# EAGLE schematic EE474FINAL (EAGLE 9.5.1)

## Sheet 1 of 2
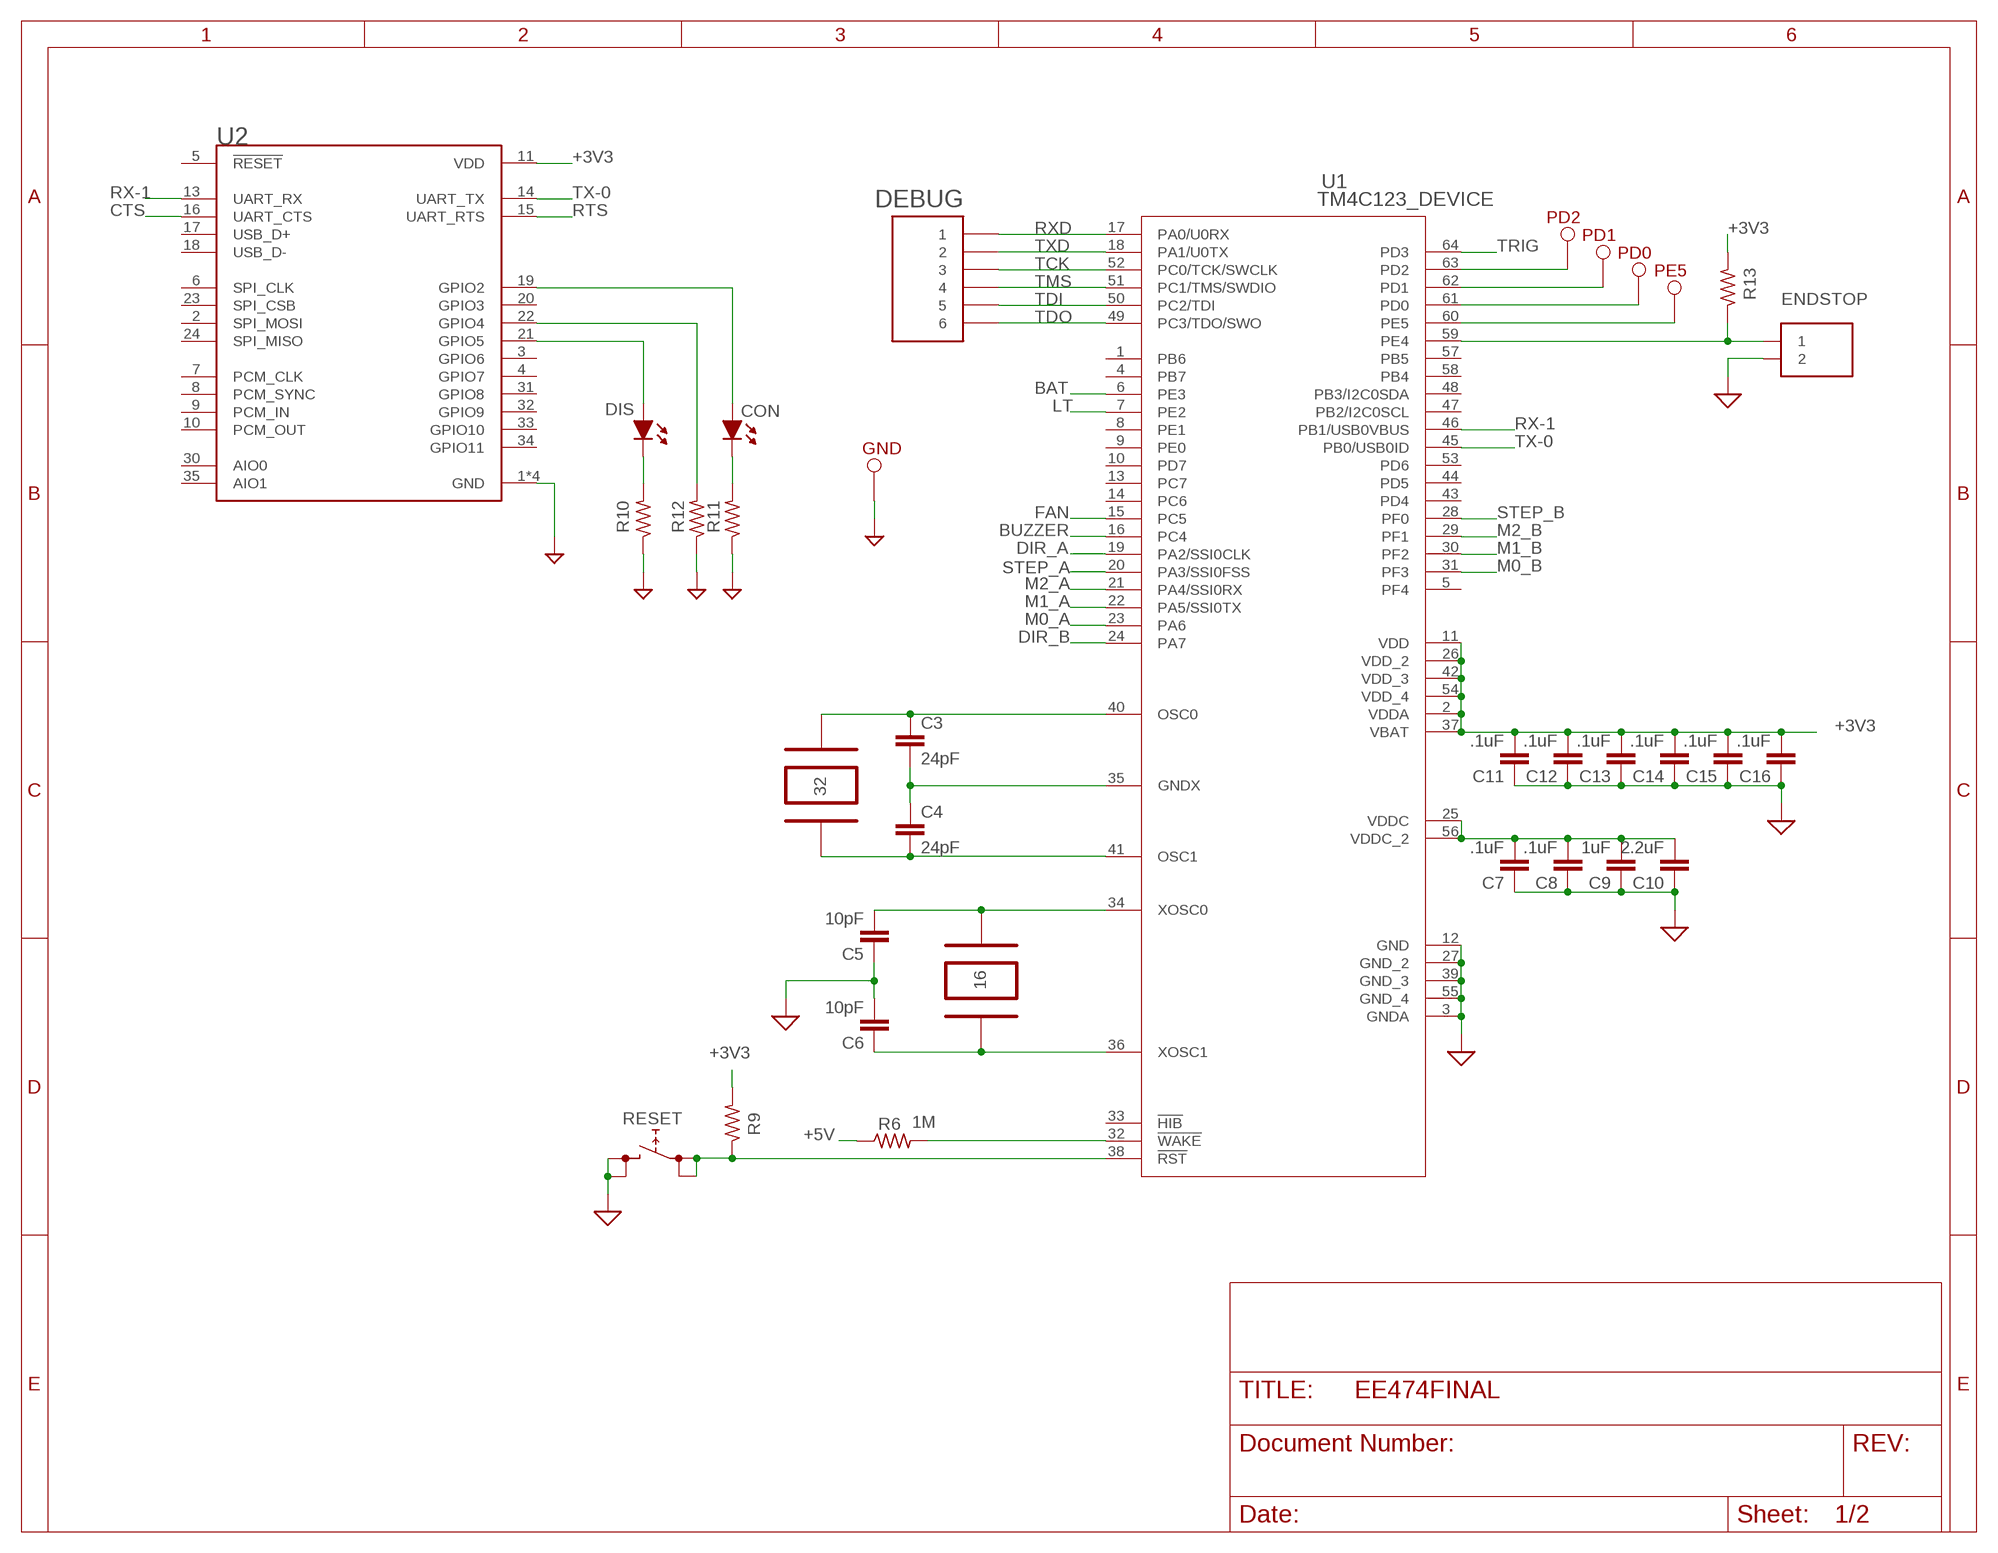
[diagram p0: schematic, sheet 1]

### Parts
C3  24pF  CAPACITOR  [CAPC1005X35N]
C4  24pF  CAPACITOR  [CAPC1005X35N]
C5  10pF  CAPACITOR  [CAPC1005X35N]
C6  10pF  CAPACITOR  [CAPC1005X35N]
C7  .1uF  CAPACITOR  [CAPC1005X35N]
C8  .1uF  CAPACITOR  [CAPC1005X35N]
C9  1uF  CAPACITOR  [CAPC1005X35N]
C10  2.2uF  CAPACITOR  [CAPC1005X35N]
C11  .1uF  CAPACITOR  [CAPC1005X35N]
C12  .1uF  CAPACITOR  [CAPC1005X35N]
C13  .1uF  CAPACITOR  [CAPC1005X35N]
C14  .1uF  CAPACITOR  [CAPC1005X35N]
C15  .1uF  CAPACITOR  [CAPC1005X35N]
C16  .1uF  CAPACITOR  [CAPC1005X35N]
CON  LED_511  [LED_511]
DEBUG  6POS_JST  [6POS_JST]
DIS  LED_511  [LED_511]
ENDSTOP  2POS_JSTVERT_2.0  [2POS_JSTVERT_2.00]
GND  TESTPOINT  [TESTPOINT]
PD0  TESTPOINT  [TESTPOINT]
PD1  TESTPOINT  [TESTPOINT]
PD2  TESTPOINT  [TESTPOINT]
PE5  TESTPOINT  [TESTPOINT]
R6  1M  RESISTOR  [CAPC1005X35N]
R9  RESISTOR  [CAPC1005X35N]
R10  RESISTOR  [CAPC1005X35N]
R11  RESISTOR  [CAPC1005X35N]
R12  RESISTOR  [CAPC1005X35N]
R13  RESISTOR  [CAPC1005X35N]
RESET  SWITCH_B3S  [SW_BS3]
U1  TM4C123_DEVICE  [TM3C123_FOOTPRINT]
U2  RN42-I/RM  [XCVR_RN42-I/RM]
Y1  32kHz  32KHZ_OSCILATOR  [GHI2_CRYSTAL_3.2X1.5]
Y2  Y2  16MHZ_OSCILLATOR  [CRYSTAL_16MHZ]

### Nets
!RST: R9.1 RESET.1 RESET.2 U1.38(!RST)
!WAKE: R6.2 U1.32(!WAKE)
+3V3: C11.2 C12.2 C13.2 C14.2 C15.2 C16.2 R9.2 R13.2 U1.2(VDDA) U1.11(VDD) U1.26(VDD_2) U1.37(VBAT) U1.42(VDD_3) U1.54(VDD_4) U2.11(VDD) ; also sheet 2
+5V: R6.1 ; also sheet 2
BAT: U1.6(PE3) ; also sheet 2
BUZZER: U1.16(PC4) ; also sheet 2
CTS: U2.16(UART_CTS)
DIR_A: U1.19(PA2/SSI0CLK) ; also sheet 2
DIR_B: U1.24(PA7) ; also sheet 2
FAN: U1.15(PC5) ; also sheet 2
GND: C5.1 C6.2 C7.1 C8.1 C9.1 C10.1 C11.1 C12.1 C13.1 C14.1 C15.1 C16.1 ENDSTOP.2 GND.P$1 R10.1 R11.1 R12.1 RESET.3 RESET.4 U1.3(GNDA) U1.12(GND) U1.27(GND_2) U1.39(GND_3) U1.55(GND_4) U2.1(GND) U2.12(GND) U2.28(GND) U2.29(GND) ; supply symbol labelled SUP ; also sheet 2
GNDX: C3.2 C4.1 U1.35(GNDX)
LT: U1.7(PE2) ; also sheet 2
M0_A: U1.23(PA6) ; also sheet 2
M0_B: U1.31(PF3) ; also sheet 2
M1_A: U1.22(PA5/SSI0TX) ; also sheet 2
M1_B: U1.30(PF2) ; also sheet 2
M2_A: U1.21(PA4/SSI0RX) ; also sheet 2
M2_B: U1.29(PF1) ; also sheet 2
N$15: ENDSTOP.1 R13.1 U1.59(PE4)
N$18: DIS.P$2 U2.21(GPIO5)
N$22: DIS.P$1 R10.2
N$23: CON.P$1 R11.2
N$24: CON.P$2 U2.19(GPIO2)
N$25: R12.2 U2.22(GPIO4)
OSC0: C3.1 U1.40(OSC0) Y1.P$2
OSC1: C4.2 U1.41(OSC1) Y1.P$1
PD0: PD0.P$1 U1.61(PD0)
PD1: PD1.P$1 U1.62(PD1)
PD2: PD2.P$1 U1.63(PD2)
PE5: PE5.P$1 U1.60(PE5)
RTS: U2.15(UART_RTS)
RX-1: U1.46(PB1/USB0VBUS) U2.13(UART_RX)
RXD: DEBUG.6 U1.17(PA0/U0RX)
STEP_A: U1.20(PA3/SSI0FSS) ; also sheet 2
STEP_B: U1.28(PF0) ; also sheet 2
TCK: DEBUG.4 U1.52(PC0/TCK/SWCLK)
TDI: DEBUG.2 U1.50(PC2/TDI)
TDO: DEBUG.1 U1.49(PC3/TDO/SWO)
TMS: DEBUG.3 U1.51(PC1/TMS/SWDIO)
TRIG: U1.64(PD3) ; also sheet 2
TX-0: U1.45(PB0/USB0ID) U2.14(UART_TX)
TXD: DEBUG.5 U1.18(PA1/U0TX)
VDDC: C7.2 C8.2 C9.2 C10.2 U1.25(VDDC) U1.56(VDDC_2)
XOSC0: C5.2 U1.34(XOSC0) Y2.2
XOSC1: C6.1 U1.36(XOSC1) Y2.1
Unconnected: U1.1(PB6) U1.4(PB7) U1.5(PF4) U1.8(PE1) U1.9(PE0) U1.10(PD7) U1.13(PC7) U1.14(PC6) U1.33(!HIB) U1.43(PD4) U1.44(PD5) U1.47(PB2/I2C0SCL) U1.48(PB3/I2C0SDA) U1.53(PD6) U1.57(PB5) U1.58(PB4) U2.2(SPI_MOSI) U2.3(GPIO6) U2.4(GPIO7) U2.5(!RESET) U2.6(SPI_CLK) U2.7(PCM_CLK) U2.8(PCM_SYNC) U2.9(PCM_IN) U2.10(PCM_OUT) U2.17(USB_D+) U2.18(USB_D-) U2.20(GPIO3) U2.23(SPI_CSB) U2.24(SPI_MISO) U2.30(AIO0) U2.31(GPIO8) U2.32(GPIO9) U2.33(GPIO10) U2.34(GPIO11) U2.35(AIO1)

## Sheet 2 of 2
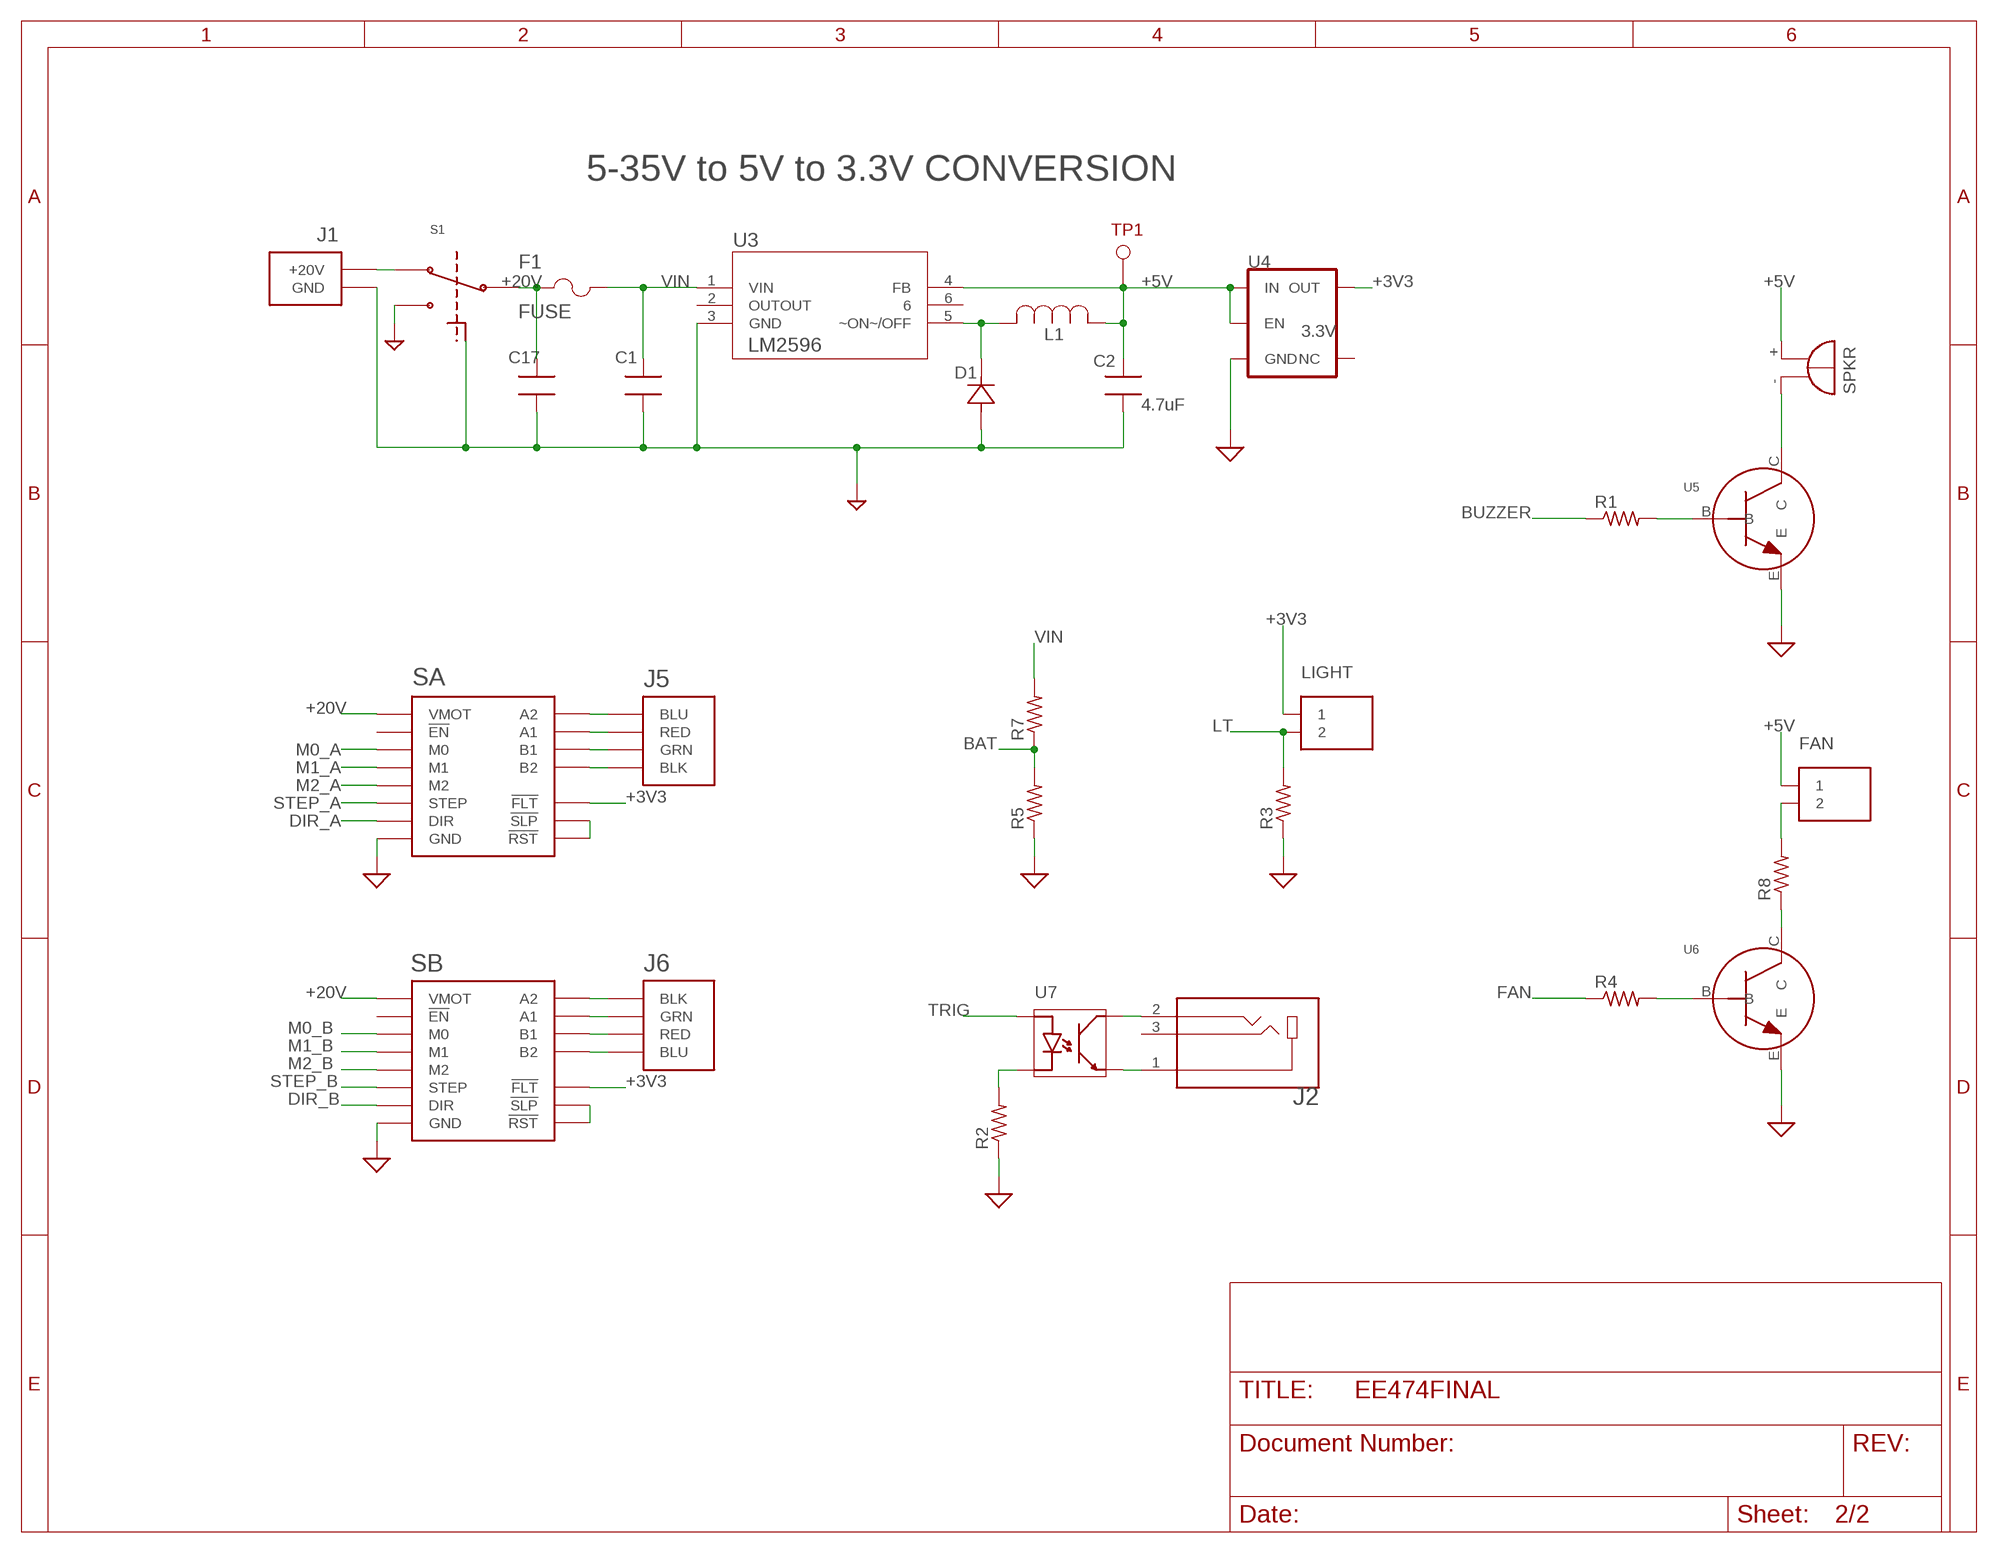
[diagram p1: schematic, sheet 2]

### Parts
C1  CAP_18  [CAP_ULH_10X10]
C2  4.7uF  CAP_4.7  [CAP_UCD_8X6P2]
C17  CAP_18  [CAP_ULH_10X10]
D1  DIODE_SHOTKY_SMA  [SMA]
F1  FUSE  [FUS_VISHAY_MFU0805]
FAN  2POS_JSTVERT_2.0  [2POS_JSTVERT_2.00]
J1  2POS_JSTVERT_2.5  [2POS_JSTVERT]
J2  AUDIOJACK  [AUDIOJACK]
J5  4POS_MOLEXVERT  [4POS_MOLEXVERT]
J6  4POS_MOLEX_2.54  [MOLEX_0705530003]
L1  INDUCTOR_SRR1210-680M  [IND_BOURNS_SRR1210]
LIGHT  2POS_JSTVERT_2.0  [2POS_JSTVERT_2.00]
R1  R-US_R0402  [R0402]
R2  R-US_R0402  [R0402]
R3  R-US_R0402  [R0402]
R4  R-US_R0402  [R0402]
R5  R-US_R0402  [R0402]
R7  R-US_R0402  [R0402]
R8  R-US_R0402  [R0402]
S1  SLIDESWITCH  [SLIDESWITCH]
SA  DRV8825  [DRV8825]
SB  DRV8825  [DRV8825]
SPKR  F/QMBIII  [F/QMBIII]
TP1  TESTPOINT  [TESTPOINT]
U3  LM2596SX-5.0/NOPB  [TS5B]
U4  3.3V  V_REG_AP2112K-3.3V  [SOT23-5]
U5  NPN_BJT  [SOT-23]
U6  NPN_BJT  [SOT-23]
U7  OPTOISOLATOR  [SOP-4L_TC]

### Nets
20IN: J1.P$1(+20V) S1.1
+3V3: LIGHT.1 SA.!FLT SB.!FLT U4.5(OUT) ; also sheet 1
+5V: C2.1 FAN.1 L1.1 SPKR.+(-) TP1.P$1 U3.4(FB) U4.1(IN) U4.3(EN) ; also sheet 1
+20V: C17.1 F1.1 S1.2 SA.VMOT SB.VMOT
BAT: R5.2 R7.1 ; also sheet 1
BUZZER: R1.1 ; also sheet 1
DIR_A: SA.DIR ; also sheet 1
DIR_B: SB.DIR ; also sheet 1
FAN: R4.1 ; also sheet 1
FAN_OUT: FAN.2 R8.2
GND: C1.2 C2.2 C17.2 D1.2 J1.P$2(GND) R2.1 R3.1 R5.1 S1.3 S1.4(GND) S1.5(GND) SA.GND$1(GND) SA.GND$2(GND) SB.GND$1(GND) SB.GND$2(GND) U3.3(GND) U4.2(GND) U5.E U6.E ; supply symbol labelled SUP ; also sheet 1
LT: LIGHT.2 R3.2 ; also sheet 1
M0_A: SA.M0 ; also sheet 1
M0_B: SB.M0 ; also sheet 1
M1_A: SA.M1 ; also sheet 1
M1_B: SB.M1 ; also sheet 1
M2_A: SA.M2 ; also sheet 1
M2_B: SB.M2 ; also sheet 1
N$1: R1.2 U5.B
N$2: SPKR.-(+) U5.C
N$3: J2.2 U7.4
N$4: J2.1 U7.3
N$5: J6.4(BLK) SB.A2
N$6: R2.2 U7.2
N$7: R4.2 U6.B
N$8: J5.P$4(BLU) SA.A2
N$9: J5.P$3(RED) SA.A1
N$10: J5.P$2(GRN) SA.B1
N$11: J5.P$1(BLK) SA.B2
N$12: J6.3(GRN) SB.A1
N$13: J6.2(RED) SB.B1
N$14: J6.1(BLU) SB.B2
N$16: SB.!RST SB.!SLP
N$17: SA.!RST SA.!SLP
N$20: R8.1 U6.C
PWM: D1.1 L1.2 U3.5(~ON~/OFF)
STEP_A: SA.STEP ; also sheet 1
STEP_B: SB.STEP ; also sheet 1
TRIG: U7.1 ; also sheet 1
VIN: C1.1 F1.2 R7.2 U3.1(VIN)
Unconnected: J2.3 SA.!EN SB.!EN U3.2(OUTOUT) U3.6 U4.4(NC)

### Notes on the sheet
- 5-35V to 5V to 3.3V CONVERSION

## Library data of the parts
C1 C17 = FillControl:CAP_18; MANUFACTURER_PART_NUMBER: ULT2D180MNL1GS; VENDOR: Nichicon
C2 = FillControl:CAP_4.7; MANUFACTURER_PART_NUMBER: UUX2A4R7MCL1GS; VENDOR: Nichicon
C3-C16 = MICROCONTROLLER:CAPACITOR
CON DIS = MICROCONTROLLER:LED_511
D1 = MICROCONTROLLER:DIODE_SHOTKY_SMA; MANUFACTURER_PART_NUMBER: S1M13F; VENDOR: Diodes Inc
DEBUG = MICROCONTROLLER:6POS_JST; MANUFACTURER_PART_NUMBER: S6BZRLFSN; VENDOR: JST
ENDSTOP FAN LIGHT = MICROCONTROLLER:2POS_JSTVERT_2.0
F1 = FillControl:FUSE; MANUFACTURER_PART_NUMBER: MFU0805FF02000P100; VENDOR: VISHAY
GND PD0 PD1 PD2 PE5 TP1 = MICROCONTROLLER:TESTPOINT
J1 = MICROCONTROLLER:2POS_JSTVERT_2.5
J2 = MICROCONTROLLER:AUDIOJACK: 3.5 mm Right-Angle Stereo Jack, 3 Pin PCB Mount, Non-Threaded; AVAILABILITY: Unavailable; CUI_PURCHASE_URL: https://www.cuidevices.com/product/interconnect/connectors/audio-connectors/jacks/sj1-352xn-series?utm_source=snapeda.com&utm_medium=referral&utm_campaign=snapedaBOM; DESCRIPTION: 3.5 mm, Stereo, Right Angle, Through Hole, Audio Jack Connector; MF: CUI Devices; MP: SJ1-3523N; PACKAGE: None; PRICE: None
J5 = MICROCONTROLLER:4POS_MOLEXVERT
J6 = MICROCONTROLLER:4POS_MOLEX_2.54
L1 = FillControl:INDUCTOR_SRR1210-680M; MANUFACTURER_PART_NUMBER: SRR1210680M; VENDOR: Bourns Electronics
R1-R5 R7 R8 = rcl:R-US_: RESISTOR, American symbol; SPICEPREFIX: R
R6 R9-R13 = MICROCONTROLLER:RESISTOR
RESET = MICROCONTROLLER:SWITCH_B3S
S1 = MICROCONTROLLER:SLIDESWITCH
SA SB = MICROCONTROLLER:DRV8825
SPKR = buzzer:F/QMBIII: BUZZER Source: Buerklin; OC_FARNELL: unknown; OC_NEWARK: unknown
U1 = MICROCONTROLLER:TM4C123_DEVICE
U2 = MICROCONTROLLER:RN42-I/RM: Bluetooth 2.1 class 2 surface mount module with built in antenna; DESCRIPTION: Bluetooth Module; DIGI-KEY_PART_NUMBER: 740-1038-ND; DIGI-KEY_PURCHASE_URL: https://www.digikey.com/product-detail/en/microchip-technology/RN42-I-RM/740-1038-ND/2357707?utm_source=snapeda&utm_medium=aggregator&utm_campaign=symbol; MF: Microchip; MP: RN42-I/RM; PACKAGE: SMD-35 Roving Networks
U3 = FillControl:LM2596SX-5.0/NOPB; MANUFACTURER_PART_NUMBER: LM2596SX5.0NOPB; VENDOR: Texas Instruments
U4 = SparkFun-IC-Power:V_REG_AP2112: AP2112 - 600mA CMOS LDO Regulator w/ Enable The AP2112 is CMOS process low dropout linear regulator with enable function, the regulator delivers a guaranteed 600mA (min.) continuous load current. Features Output Voltage Accuracy: ±1.5% Output Current: 600mA (Min.) Foldback Short Current Protection: 50mA Enable Function to Turn ON/OFF VOUT Low Dropout Voltage (3.3V): 250mV (Typ.) @IOUT=600mA Excellent Load Regulation: 0.2%/A (Typ.) Excellent Line Regulation: 0.02%/V (Typ.) Low Quiescent Current: 55μA (Typ.) Low Standby Current: 0.01μA (Typ.) Low Output Noise: 50μVRMS PSRR: 100Hz -65dB, 1kHz -65dB OTSD Protection Stable with 1.0μF Flexible Cap: Ceramic, Tantalum and Aluminum Electrolytic Operation Temperature Range: -40°C to 85°C ESD: MM 400V, HBM 4000V; PROD_ID: VREG-12457
U5 U6 = FillControl:NPN_BJT
U7 = FillControl:OPTOISOLATOR
Y1 = MICROCONTROLLER:32KHZ_OSCILATOR
Y2 = MICROCONTROLLER:16MHZ_OSCILLATOR